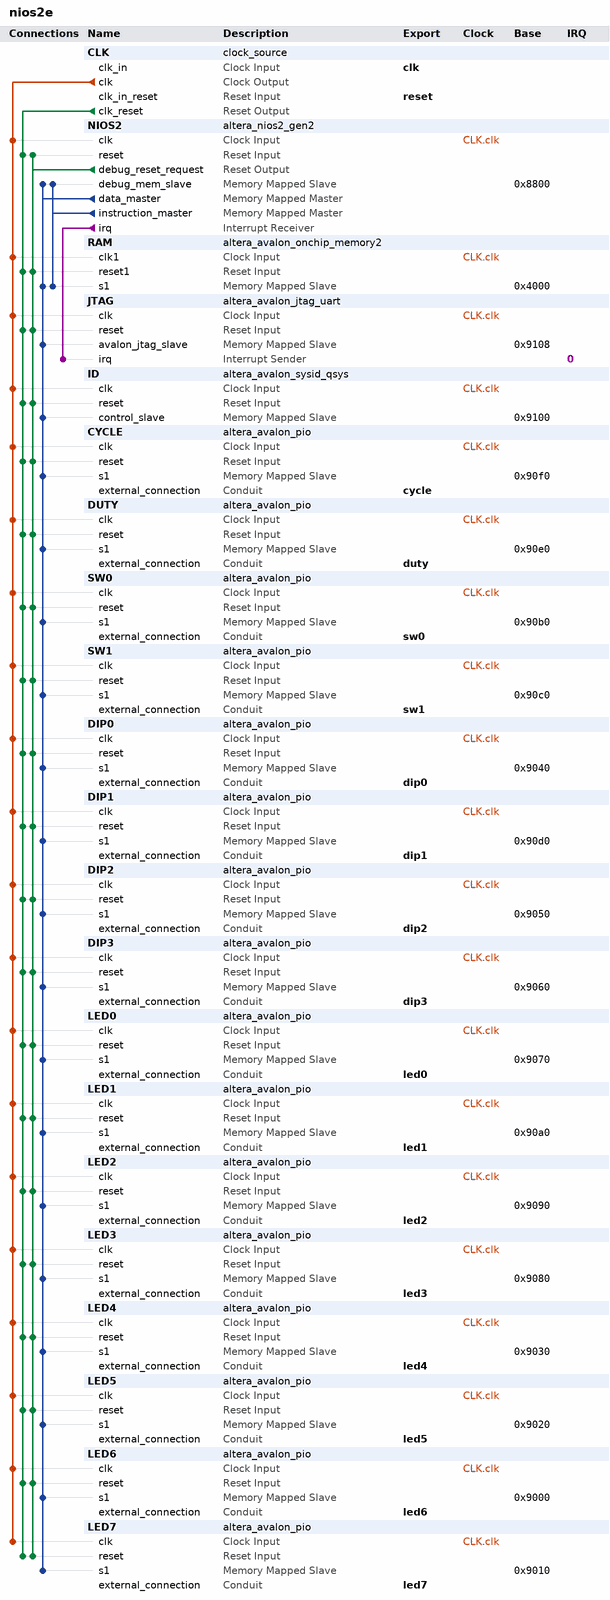
[diagram p0: system contents]
# Platform Designer (Qsys) system nios2e, Cyclone IV E EP4CE22F17C6
# Parameters at their usual value, and those the tool derives, are not listed.
package require -exact qsys 18.1
create_system nios2e
set_project_property DEVICE_FAMILY {Cyclone IV E}
set_project_property DEVICE EP4CE22F17C6

add_instance CLK clock_source 18.1
set_instance_parameter_value CLK clockFrequency 50000000

add_instance NIOS2 altera_nios2_gen2 18.1
set_instance_parameter_value NIOS2 dcache_size 2048
set_instance_parameter_value NIOS2 exceptionSlave RAM.s1
set_instance_parameter_value NIOS2 icache_size 4096
set_instance_parameter_value NIOS2 impl Tiny
set_instance_parameter_value NIOS2 resetSlave RAM.s1

add_instance RAM altera_avalon_onchip_memory2 18.1
set_instance_parameter_value RAM dataWidth 32
set_instance_parameter_value RAM dualPort false
set_instance_parameter_value RAM initMemContent true
set_instance_parameter_value RAM initializationFileName onchip_mem.hex
set_instance_parameter_value RAM memorySize 16384

add_instance JTAG altera_avalon_jtag_uart 18.1
set_instance_parameter_value JTAG simInteractiveOptions NO_INTERACTIVE_WINDOWS

add_instance ID altera_avalon_sysid_qsys 18.1
set_instance_parameter_value ID id 0

add_instance CYCLE altera_avalon_pio 18.1
set_instance_parameter_value CYCLE direction Output
set_instance_parameter_value CYCLE width 28

add_instance DUTY altera_avalon_pio 18.1
set_instance_parameter_value DUTY direction Output
set_instance_parameter_value DUTY width 28

add_instance SW0 altera_avalon_pio 18.1
set_instance_parameter_value SW0 direction Input
set_instance_parameter_value SW0 width 16

add_instance SW1 altera_avalon_pio 18.1
set_instance_parameter_value SW1 direction Input
set_instance_parameter_value SW1 width 16

add_instance DIP0 altera_avalon_pio 18.1
set_instance_parameter_value DIP0 direction Input
set_instance_parameter_value DIP0 width 1

add_instance DIP1 altera_avalon_pio 18.1
set_instance_parameter_value DIP1 direction Input
set_instance_parameter_value DIP1 width 16

add_instance DIP2 altera_avalon_pio 18.1
set_instance_parameter_value DIP2 direction Input
set_instance_parameter_value DIP2 width 1

add_instance DIP3 altera_avalon_pio 18.1
set_instance_parameter_value DIP3 direction Input
set_instance_parameter_value DIP3 width 1

add_instance LED0 altera_avalon_pio 18.1
set_instance_parameter_value LED0 direction Output
set_instance_parameter_value LED0 width 1

add_instance LED1 altera_avalon_pio 18.1
set_instance_parameter_value LED1 direction Output
set_instance_parameter_value LED1 width 1

add_instance LED2 altera_avalon_pio 18.1
set_instance_parameter_value LED2 direction Output
set_instance_parameter_value LED2 width 1

add_instance LED3 altera_avalon_pio 18.1
set_instance_parameter_value LED3 direction Output
set_instance_parameter_value LED3 width 1

add_instance LED4 altera_avalon_pio 18.1
set_instance_parameter_value LED4 direction Output
set_instance_parameter_value LED4 width 1

add_instance LED5 altera_avalon_pio 18.1
set_instance_parameter_value LED5 direction Output
set_instance_parameter_value LED5 width 1

add_instance LED6 altera_avalon_pio 18.1
set_instance_parameter_value LED6 direction Output
set_instance_parameter_value LED6 width 1

add_instance LED7 altera_avalon_pio 18.1
set_instance_parameter_value LED7 direction Output
set_instance_parameter_value LED7 width 1

# connections
add_connection CLK.clk CYCLE.clk clock
add_connection CLK.clk DIP0.clk clock
add_connection CLK.clk DIP1.clk clock
add_connection CLK.clk DIP2.clk clock
add_connection CLK.clk DIP3.clk clock
add_connection CLK.clk DUTY.clk clock
add_connection CLK.clk ID.clk clock
add_connection CLK.clk JTAG.clk clock
add_connection CLK.clk LED0.clk clock
add_connection CLK.clk LED1.clk clock
add_connection CLK.clk LED2.clk clock
add_connection CLK.clk LED3.clk clock
add_connection CLK.clk LED4.clk clock
add_connection CLK.clk LED5.clk clock
add_connection CLK.clk LED6.clk clock
add_connection CLK.clk LED7.clk clock
add_connection CLK.clk NIOS2.clk clock
add_connection CLK.clk RAM.clk1 clock
add_connection CLK.clk SW0.clk clock
add_connection CLK.clk SW1.clk clock
add_connection CLK.clk_reset CYCLE.reset reset
add_connection CLK.clk_reset DIP0.reset reset
add_connection CLK.clk_reset DIP1.reset reset
add_connection CLK.clk_reset DIP2.reset reset
add_connection CLK.clk_reset DIP3.reset reset
add_connection CLK.clk_reset DUTY.reset reset
add_connection CLK.clk_reset ID.reset reset
add_connection CLK.clk_reset JTAG.reset reset
add_connection CLK.clk_reset LED0.reset reset
add_connection CLK.clk_reset LED1.reset reset
add_connection CLK.clk_reset LED2.reset reset
add_connection CLK.clk_reset LED3.reset reset
add_connection CLK.clk_reset LED4.reset reset
add_connection CLK.clk_reset LED5.reset reset
add_connection CLK.clk_reset LED6.reset reset
add_connection CLK.clk_reset LED7.reset reset
add_connection CLK.clk_reset NIOS2.reset reset
add_connection CLK.clk_reset RAM.reset1 reset
add_connection CLK.clk_reset SW0.reset reset
add_connection CLK.clk_reset SW1.reset reset
add_connection NIOS2.debug_reset_request CYCLE.reset reset
add_connection NIOS2.debug_reset_request DIP0.reset reset
add_connection NIOS2.debug_reset_request DIP1.reset reset
add_connection NIOS2.debug_reset_request DIP2.reset reset
add_connection NIOS2.debug_reset_request DIP3.reset reset
add_connection NIOS2.debug_reset_request DUTY.reset reset
add_connection NIOS2.debug_reset_request ID.reset reset
add_connection NIOS2.debug_reset_request JTAG.reset reset
add_connection NIOS2.debug_reset_request LED0.reset reset
add_connection NIOS2.debug_reset_request LED1.reset reset
add_connection NIOS2.debug_reset_request LED2.reset reset
add_connection NIOS2.debug_reset_request LED3.reset reset
add_connection NIOS2.debug_reset_request LED4.reset reset
add_connection NIOS2.debug_reset_request LED5.reset reset
add_connection NIOS2.debug_reset_request LED6.reset reset
add_connection NIOS2.debug_reset_request LED7.reset reset
add_connection NIOS2.debug_reset_request NIOS2.reset reset
add_connection NIOS2.debug_reset_request RAM.reset1 reset
add_connection NIOS2.debug_reset_request SW0.reset reset
add_connection NIOS2.debug_reset_request SW1.reset reset
add_connection NIOS2.data_master CYCLE.s1 avalon
set_connection_parameter_value NIOS2.data_master/CYCLE.s1 baseAddress 0x90f0
add_connection NIOS2.data_master DIP0.s1 avalon
set_connection_parameter_value NIOS2.data_master/DIP0.s1 baseAddress 0x9040
add_connection NIOS2.data_master DIP1.s1 avalon
set_connection_parameter_value NIOS2.data_master/DIP1.s1 baseAddress 0x90d0
add_connection NIOS2.data_master DIP2.s1 avalon
set_connection_parameter_value NIOS2.data_master/DIP2.s1 baseAddress 0x9050
add_connection NIOS2.data_master DIP3.s1 avalon
set_connection_parameter_value NIOS2.data_master/DIP3.s1 baseAddress 0x9060
add_connection NIOS2.data_master DUTY.s1 avalon
set_connection_parameter_value NIOS2.data_master/DUTY.s1 baseAddress 0x90e0
add_connection NIOS2.data_master ID.control_slave avalon
set_connection_parameter_value NIOS2.data_master/ID.control_slave baseAddress 0x9100
add_connection NIOS2.data_master JTAG.avalon_jtag_slave avalon
set_connection_parameter_value NIOS2.data_master/JTAG.avalon_jtag_slave baseAddress 0x9108
add_connection NIOS2.data_master LED0.s1 avalon
set_connection_parameter_value NIOS2.data_master/LED0.s1 baseAddress 0x9070
add_connection NIOS2.data_master LED1.s1 avalon
set_connection_parameter_value NIOS2.data_master/LED1.s1 baseAddress 0x90a0
add_connection NIOS2.data_master LED2.s1 avalon
set_connection_parameter_value NIOS2.data_master/LED2.s1 baseAddress 0x9090
add_connection NIOS2.data_master LED3.s1 avalon
set_connection_parameter_value NIOS2.data_master/LED3.s1 baseAddress 0x9080
add_connection NIOS2.data_master LED4.s1 avalon
set_connection_parameter_value NIOS2.data_master/LED4.s1 baseAddress 0x9030
add_connection NIOS2.data_master LED5.s1 avalon
set_connection_parameter_value NIOS2.data_master/LED5.s1 baseAddress 0x9020
add_connection NIOS2.data_master LED6.s1 avalon
set_connection_parameter_value NIOS2.data_master/LED6.s1 baseAddress 0x9000
add_connection NIOS2.data_master LED7.s1 avalon
set_connection_parameter_value NIOS2.data_master/LED7.s1 baseAddress 0x9010
add_connection NIOS2.data_master NIOS2.debug_mem_slave avalon
set_connection_parameter_value NIOS2.data_master/NIOS2.debug_mem_slave baseAddress 0x8800
add_connection NIOS2.data_master RAM.s1 avalon
set_connection_parameter_value NIOS2.data_master/RAM.s1 baseAddress 0x4000
add_connection NIOS2.data_master SW0.s1 avalon
set_connection_parameter_value NIOS2.data_master/SW0.s1 baseAddress 0x90b0
add_connection NIOS2.data_master SW1.s1 avalon
set_connection_parameter_value NIOS2.data_master/SW1.s1 baseAddress 0x90c0
add_connection NIOS2.instruction_master NIOS2.debug_mem_slave avalon
set_connection_parameter_value NIOS2.instruction_master/NIOS2.debug_mem_slave baseAddress 0x8800
add_connection NIOS2.instruction_master RAM.s1 avalon
set_connection_parameter_value NIOS2.instruction_master/RAM.s1 baseAddress 0x4000
add_connection NIOS2.irq JTAG.irq interrupt
set_connection_parameter_value NIOS2.irq/JTAG.irq irqNumber 0

# exported interfaces
add_interface clk clock sink
set_interface_property clk EXPORT_OF CLK.clk_in
add_interface cycle conduit end
set_interface_property cycle EXPORT_OF CYCLE.external_connection
add_interface dip0 conduit end
set_interface_property dip0 EXPORT_OF DIP0.external_connection
add_interface dip1 conduit end
set_interface_property dip1 EXPORT_OF DIP1.external_connection
add_interface dip2 conduit end
set_interface_property dip2 EXPORT_OF DIP2.external_connection
add_interface dip3 conduit end
set_interface_property dip3 EXPORT_OF DIP3.external_connection
add_interface duty conduit end
set_interface_property duty EXPORT_OF DUTY.external_connection
add_interface led0 conduit end
set_interface_property led0 EXPORT_OF LED0.external_connection
add_interface led1 conduit end
set_interface_property led1 EXPORT_OF LED1.external_connection
add_interface led2 conduit end
set_interface_property led2 EXPORT_OF LED2.external_connection
add_interface led3 conduit end
set_interface_property led3 EXPORT_OF LED3.external_connection
add_interface led4 conduit end
set_interface_property led4 EXPORT_OF LED4.external_connection
add_interface led5 conduit end
set_interface_property led5 EXPORT_OF LED5.external_connection
add_interface led6 conduit end
set_interface_property led6 EXPORT_OF LED6.external_connection
add_interface led7 conduit end
set_interface_property led7 EXPORT_OF LED7.external_connection
add_interface reset reset sink
set_interface_property reset EXPORT_OF CLK.clk_in_reset
add_interface sw0 conduit end
set_interface_property sw0 EXPORT_OF SW0.external_connection
add_interface sw1 conduit end
set_interface_property sw1 EXPORT_OF SW1.external_connection

set_interconnect_requirement {$system} qsys_mm.clockCrossingAdapter HANDSHAKE
set_interconnect_requirement {$system} qsys_mm.enableEccProtection FALSE
set_interconnect_requirement {$system} qsys_mm.insertDefaultSlave FALSE
set_interconnect_requirement {$system} qsys_mm.maxAdditionalLatency 1

save_system nios2e.qsys
